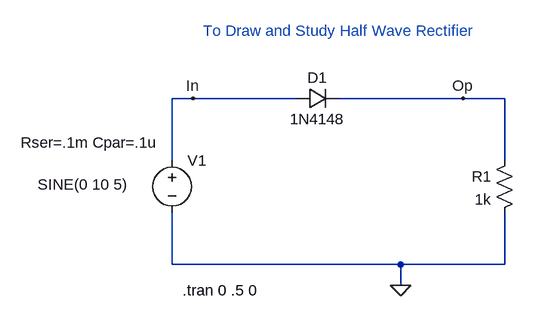
[diagram p0: schematic Half Wave Rectifier.asc]
Half Wave Rectifier.asc, the LTspice schematic file:
Version 4
SHEET 1 1148 680
WIRE -144 -1040 -176 -1040
WIRE 16 -1040 -144 -1040
WIRE 272 -1040 80 -1040
WIRE 336 -1040 272 -1040
WIRE -176 -944 -176 -1040
WIRE 336 -944 336 -1040
WIRE -176 -784 -176 -864
WIRE 176 -784 -176 -784
WIRE 336 -784 336 -864
WIRE 336 -784 176 -784
WIRE 176 -752 176 -784
FLAG 176 -752 0
FLAG -144 -1040 In
FLAG 272 -1040 Op
SYMBOL res 352 -960 M0
SYMATTR InstName R1
SYMATTR Value 1k
SYMBOL diode 16 -1024 R270
WINDOW 0 32 32 VTop 2
WINDOW 3 0 32 VBottom 2
SYMATTR InstName D1
SYMATTR Value 1N4148
SYMBOL voltage -176 -960 R0
WINDOW 3 -207 53 Left 2
WINDOW 123 0 0 Left 0
WINDOW 39 -233 -12 Left 2
SYMATTR InstName V1
SYMATTR Value SINE(0 10 5)
SYMATTR SpiceLine Rser=.1m Cpar=.1u
TEXT -128 -1144 Left 2 ;To Draw and Study Half Wave Rectifier
TEXT -160 -744 Left 2 !.tran 0 .5 0

The netlist it stands for:
* Half Wave Rectifier.asc
R1 Op 0 1k
D1 In Op 1N4148
V1 In 0 SINE(0 10 5) Rser=.1m Cpar=.1u
.model D D
.lib standard.dio
* To Draw and Study Half Wave Rectifier
.tran 0 .5 0
.backanno
.end

* Results of the author's LTspice run, read from the files saved beside the schematic
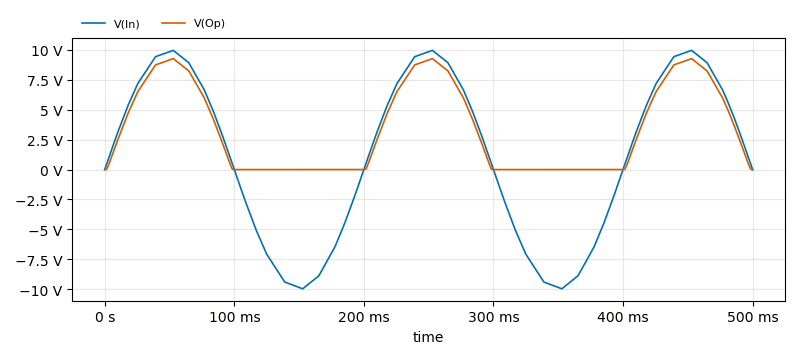
[diagram p1: Transient Analysis of Half Wave Rectifier.asc, plotted from the saved traces]
* Transient Analysis, 1 run:
*   V(In): min -9.962 V, max 9.959 V, average 1.262 V, rms 7.017 V, last 0 V
*   V(Op): min -3.446 µV, max 9.268 V, average 3.392 V, rms 4.97 V, last 0 V